# Altium schematic sheet OpenBLC_TPS62152.SchDoc
size A
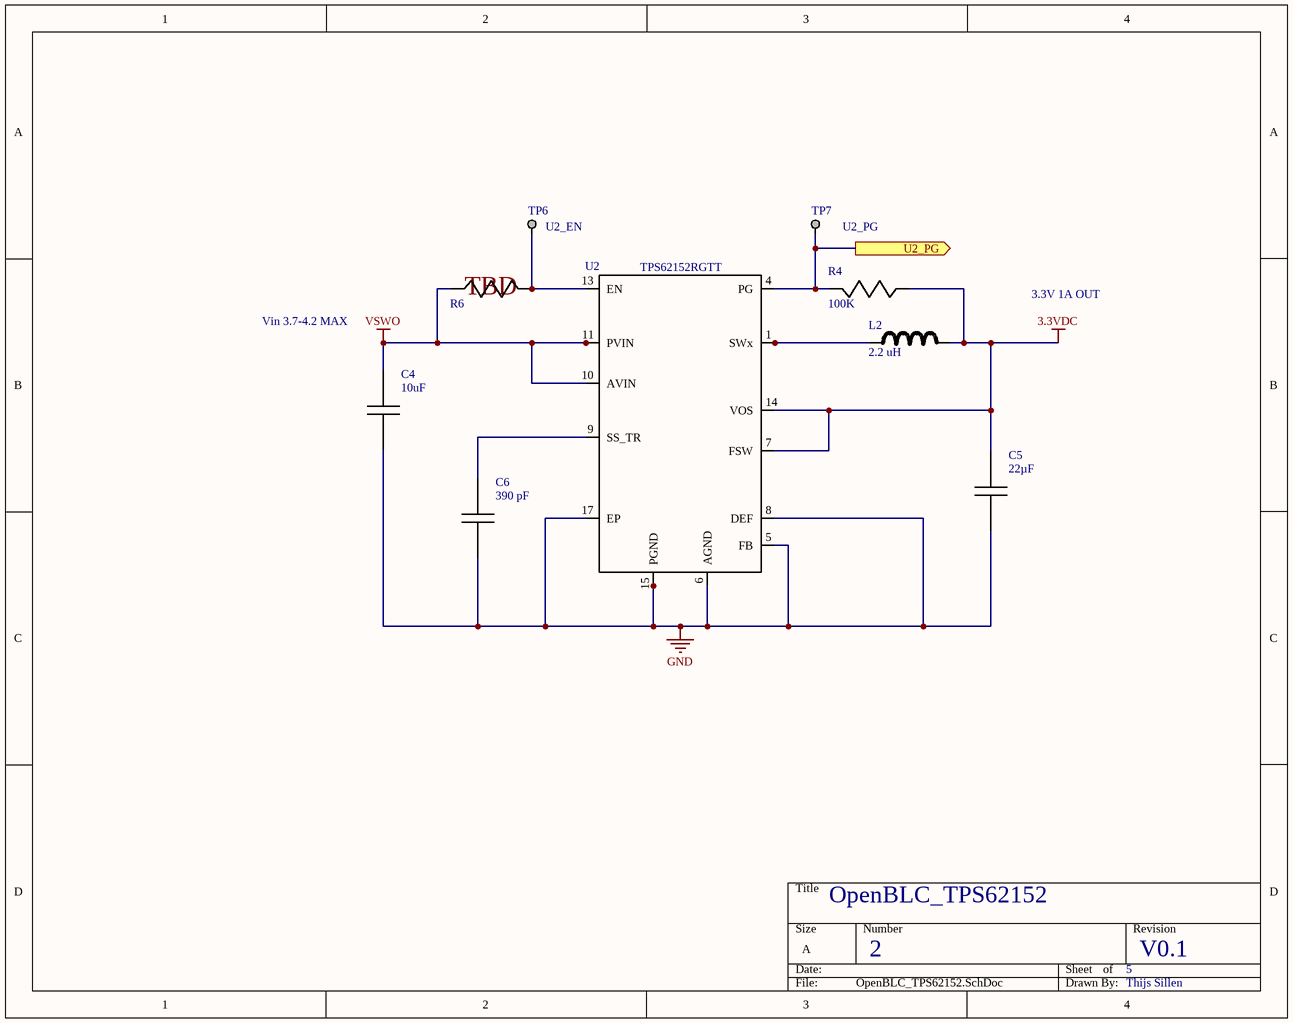
[diagram p0: OpenBLC_TPS62152.SchDoc]

## Parts
C4  Capacitance: 10uF  [0805_CAP]  (hidden comment: GRM21BR61A106KE19L)
C5  Capacitance: 22µF  [0805_CAP]  (hidden comment: C2012X5R0J226M125AC)
C6  Capaciteit: 390 pF  [0603_CAP]  (hidden comment: GRM033R71C391KA01D)
L2  Inductantie: 2.2 uH  [SDR0403]  (hidden comment: SDR0403-2R2ML)
R4  Resistance: 100K  [0402_RES]  (hidden comment: CRCW0402100KFKEDHP)
R6  0805_RES  [0805_RES]  (value not drawn)
TP6  U2_EN  [Via_TP]
TP7  U2_PG  [Via_TP]
U2  TPS62152RGTT  [TPS62152RGTR]

## Ports
U2_PG (out)

## Nets
3.3VDC: C5.1 L2.1 R4.2 U2.7(FSW) U2.14(VOS)
GND: C4.2 C5.2 C6.2 U2.5(FB) U2.6(AGND) U2.8(DEF) U2.15(PGND) U2.16(PGND) U2.17(EP)
VSWO: C4.1 R6.2 U2.10(AVIN) U2.11(PVIN) U2.12(PVIN)
U2_PG: R4.1 TP7.1 U2.4(PG) ; port U2_PG
NetC6_1: C6.1 U2.9(SS_TR)
NetL2_2: L2.2 U2.1(SWx) U2.2(SW) U2.3(SW)
NetR6_1: R6.1 TP6.1 U2.13(EN)

## Notes on the sheet
- (near R6) TBD
- 3.3V 1A OUT
- Vin 3.7-4.2 MAX
- OpenBLC_TPS62152
- 2
- 5
- V0.1
- Thijs Sillen

## Library data of the parts
C4 = GRM21BR61A106KE19L: MURATA - GRM21BR61A106KE19L - CAPACITOR, CERA, 10UF, 10%, 10V, 10%, SMD; Product Range: MURATA - GRM Series; Dielectric Characteristic: X5; Voltage Rating: 10; Ceramic Capacitor Case: 0805 ^2012 Metric]; Supplier 1: Farnell; Supplier Part Number 1: 2396552; Manufacturer: MURATA; RoHS: YES; Stock 1: 20106; Pricing 1: 1=0.042, 250=0.039, 500=0.034, 1000=0.031, 5000=0.022 (EUR); Capacitance Tolerance: ± 10%; MSL: -; ComponentLink1URL: http://www.farnell.com/datasheets/608985.pdf; ComponentLink1Description: http://www.farnell.com/datasheets/608985.pdf; Manufacturer Part Number: GRM21BR61A106KE19L
C5 = C2012X5R0J226M125AC: CAP CER 22UF 6.3V 20% X5R 0805; Manufacturer: TDK Corporation; Supplier 1: Digi-Key; Supplier Part Number 1: 445-1422-1-ND; RoHS: RoHS Compliant; Category: Capacitors; Stock 1: 147939; Pricing 1: 1=0.24, 10=0.204, 100=0.1021, 250=0.07656, 500=0.06762, 1000=0.05878 (EUR); Packaging: Cut Tape (CT); Tolerance: ±20%; Voltage - Rated: 6.3V; Temperature Coefficient: X5R; Mounting Type: Surface Mount, MLCC; Operating Temperature: -55°C ~ 85°C; Applications: General Purpose; Ratings: -; Package / Case: 0805 (2012 Metric); Size / Dimension: 0.079" L x 0.049" W (2.00mm x 1.25mm); Height - Seated (Max): -; Thickness (Max): 0.057" (1.45mm); Lead Spacing: -; Features: -; Lead Style: -; ComponentLink1URL: http://product.tdk.com/en/catalog/datasheets/mlcc_commercial_general_en.pdf; ComponentLink1Description: http://product.tdk.com/en/catalog/datasheets/mlcc_commercial_general_en.pdf; Manufacturer Part Number: C2012X5R0J226M125AC
C6 = GRM033R71C391KA01D: Meerlaagse keramische condensatoren MLCC - SMD/SMT 390pF 16 volts 10%; Manufacturer: Murata Electronics; Bedrijfstemperatuurbereik: - 55 C to + 125 C; Verpakking / doos: 0201 (0603 metric); Verpakken: Reel; Reeks: GRM; Type: General Purpose MLCC; Nominale spanning: 16 V; Code behuizing - in: 0201; Hoogte behuizing: 0.3 mm; Lengte behuizing: 0.6 mm; Diëlectrisch: X7R; Fabrikant: Murata; Maximale bedrijfstemperatuur: + 125 C; Minimale bedrijfstemperatuur: - 55 C; Standaard pakket hoeveelheid: 15000; Temperatuur Coëfficiënt / Code: +/- 15 %; Code behuizing - mm: 0603; Supplier 1: Mouser; Supplier Part Number 1: 81-GRM033R71C391KA1D; RoHS: RoHS Compliant; Category: Meerlaagse keramische condensatoren MLCC - SMD/SMT; Stock 1: 6120; Pricing 1: 1=0.088, 10=0.011, 100=0.006, 1000=0.005, 2500=0.004, 10000=0.003, 15000=0.003 (EUR); Product: General Type MLCCs; Klemtype: SMD/SMT; Tolerantie: 10 %; Nominale spanning DC: 16 V; Merk: Murata Electronics; Breedte behuizing: 0.3 mm; RoHS - Mouser: Y; Minimum Order Quantity: 1; Reeling: True; ComponentLink1URL: http://psearch.murata.com/capacitor/product/GRM033R71C391KA01%23.pdf; ComponentLink1Description: http://psearch.murata.com/capacitor/product/GRM033R71C391KA01%23.pdf; Manufacturer Part Number: GRM033R71C391KA01D
L2 = SDR0403-2R2ML: Vaste smoorspoelen 2.2uH 20% SMD 0403; Manufacturer: Bourns; Maximale DC stroom: 2.6 A; Maximale DC weerstand: 47 mOhms; Verpakken: Reel; Q minimaal: 28; Zelfresonantiefrequentie: 80 MHz; Klemtype: SMD/SMT; Lengte behuizing: 4.5 mm; Breedte behuizing: 3.2 mm; Productcategorie: Inductors; Standaard pakket hoeveelheid: 2000; Supplier 1: Mouser; Supplier Part Number 1: 652-SDR0403-2R2ML; RoHS: RoHS Compliant; Category: Vaste smoorspoelen; Stock 1: 11347; Pricing 1: 1=0.378, 10=0.279, 100=0.257, 250=0.244, 500=0.202, 1000=0.171, 2000=0.169 (EUR); Reeks: SDR0403; Tolerantie: 20 %; Merk: Bourns; Fabrikant: Bourns; RoHS - Mouser: Y; Minimum Order Quantity: 1; Reeling: True; ComponentLink1URL: http://www.bourns.com/data/global/pdfs/sdr0403.pdf; ComponentLink1Description: http://www.bourns.com/data/global/pdfs/sdr0403.pdf; Manufacturer Part Number: SDR0403-2R2ML
R4 = CRCW0402100KFKEDHP: VISHAY DRALORIC - CRCW0402100KFKEDHP - RESISTOR, POWER, 100K, 0.125W, 1%; Product Range: VISHAY - CRCW Series; Power Rating: 125; Resistor Case Style: 0402 [1005 Metric]; Resistor Element Material: Thick Film; Temperature Coefficient: ± 100; Voltage Rating: 50; SVHC: No SVHC (16-Dec-2013); External Width: 1; Resistor Mounting: SMD<!--FANDB--><div class="features-and-benefits-container"></div>; Supplier 1: Farnell; Supplier Part Number 1: 1738877; Manufacturer: VISHAY DRALORIC; RoHS: Y-EX; Stock 1: 20841; Pricing 1: 25=0.032, 100=0.024, 500=0.016, 1000=0.011, 10000=0.008 (EUR); Resistance Tolerance: ± 1%; Packaging: Cut Tape; MSL: MSL 1 - Unlimited; ComponentLink1URL: http://www.farnell.com/datasheets/1703058.pdf; ComponentLink1Description: http://www.farnell.com/datasheets/1703058.pdf; Manufacturer Part Number: CRCW0402100KFKEDHP
TP6 TP7 = TESTPOINT: TESTPOINT SCOPE GRABBER; Manufacturer Part Number: 5010; Manufacturer: Keystone Electronics; Reel: TH; Supplier 1: Digi-Key; Supplier Part Number 1: 5010K-ND
U2 = TPS62152RGTT: Manufacturer: Texas Instruments; Output Type: Fixed; Number of Outputs: 1; Voltage - Output: 3.3V; Voltage - Input: 3 V ~ 17 V; Frequency - Switching: 2.5MHz; Current - Output: 1A; Synchronous Rectifier: Yes; Supplier 1: Digi-Key; RoHS: RoHS Compliant; Category: Integrated Circuits (ICs); Stock 1: 1028; Pricing 1: 1=2.99, 10=2.696, 25=2.4148, 100=2.1715 (USD); Packaging: Cut Tape (CT); Type: Step-Down (Buck); Operating Temperature: -40°C ~ 85°C; Mounting Type: Surface Mount; Package / Case: 16-VFQFN Exposed Pad; Supplier Device Package: 16-QFN (3x3); ComponentLink1URL: http://www.ti.com/lit/ds/symlink/tps62151.pdf; ComponentLink1Description: http://www.ti.com/lit/ds/symlink/tps62151.pdf; Supplier Part Number 1: 296-30009-1-ND